# EAGLE design przetwornice5V,3V3,-5V (EAGLE 6.3)
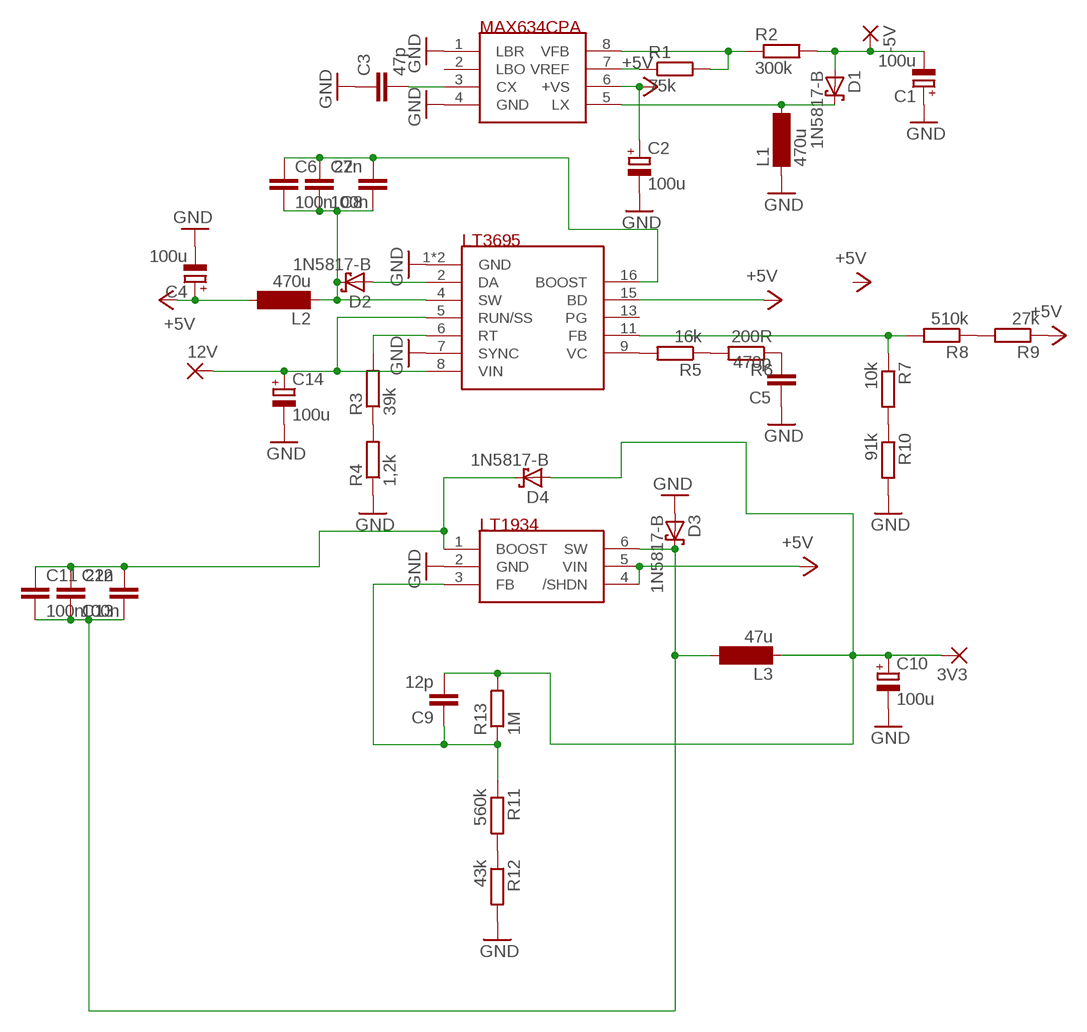
[diagram p0: schematic, sheet 1]

## Parts
3V3  WIREPAD2,54/0,8  [2,54/0,8]
12V  WIREPAD2,54/0,8  [2,54/0,8]
-5V  WIREPAD2,54/0,8  [2,54/0,8]
C1  100u  CPOL-EUE2.5-7  [E2,5-7]
C2  100u  CPOL-EUE2.5-7  [E2,5-7]
C3  47p  C2.5/2  [C2.5-2]
C4  100u  CPOL-EUE2.5-7  [E2,5-7]
C5  470p  C2.5/2  [C2.5-2]
C6  100n  C-EUC0805  [C0805]
C7  100n  C-EUC0805  [C0805]
C8  22n  C2.5/2  [C2.5-2]
C9  12p  C2.5/2  [C2.5-2]
C10  100u  CPOL-EUE2.5-7  [E2,5-7]
C11  100n  C-EUC0805  [C0805]
C12  100n  C-EUC0805  [C0805]
C13  22n  C2.5/2  [C2.5-2]
C14  100u  CPOL-EUE2.5-7  [E2,5-7]
D1  1N5817-B  [DO41-7.6]
D2  1N5817-B  [DO41-7.6]
D3  1N5817-B  [DO41-7.6]
D4  1N5817-B  [DO41-7.6]
L1  470u  MS50  [MS50]
L2  470u  MS50  [MS50]
L3  47u  MS50  [MS50]
R1  75k  R-EU_R0805  [R0805]
R2  300k  R-EU_R0805  [R0805]
R3  39k  R-EU_R0805  [R0805]
R4  1,2k  R-EU_R0805  [R0805]
R5  16k  R-EU_R0805  [R0805]
R6  200R  R-EU_R0805  [R0805]
R7  10k  R-EU_R0805  [R0805]
R8  510k  R-EU_R0805  [R0805]
R9  27k  R-EU_R0805  [R0805]
R10  91k  R-EU_R0805  [R0805]
R11  560k  R-EU_R0805  [R0805]
R12  43k  R-EU_R0805  [R0805]
R13  1M  R-EU_0207/10  [0207/10]
U$1  MAX634CPA  [DIL08]
U$2  LT3695  [MSOP16]
U$3  LT1934  [SOT23-6]

## Nets
+5V: C2.+ C4.+ L2.2 R9.1 U$1.6(+VS) U$2.15(BD) U$3.4(/SHDN) U$3.5(VIN)
GND: C1.+ C2.- C3.1 C4.- C5.1 C10.- C14.- D3.A L1.1 R4.1 R10.2 R12.2 U$1.1(LBR) U$1.4(GND) U$2.1(GND) U$2.7(SYNC) U$2.14(GND) U$3.2(GND)
N$1: R1.1 U$1.7(VREF)
N$2: R1.2 R2.1 U$1.8(VFB)
N$3: -5V.1(P) C1.- D1.A R2.2
N$4: D1.C L1.2 U$1.5(LX)
N$5: C3.2 U$1.3(CX)
N$6: 12V.1(P) C14.+ U$2.5(RUN/SS) U$2.8(VIN)
N$7: C11.2 C12.2 C13.1 D3.C L3.2 U$3.6(SW)
N$8: D2.A U$2.2(DA)
N$9: R3.1 R4.2
N$10: R3.2 U$2.6(RT)
N$11: R5.2 U$2.9(VC)
N$12: R5.1 R6.2
N$13: R7.1 R8.2 U$2.11(FB)
N$14: C5.2 R6.1
N$15: R8.1 R9.2
N$16: R7.2 R10.1
N$17: C6.1 C7.1 C8.2 U$2.16(BOOST)
N$18: C6.2 C7.2 C8.1 D2.C L2.1 U$2.4(SW)
N$20: R11.2 R12.1
N$21: C9.1 R11.1 R13.1 U$3.3(FB)
N$25: C11.1 C12.1 C13.2 D4.C U$3.1(BOOST)
N$26: 3V3.1(P) C9.2 C10.+ D4.A L3.1 R13.2
Unconnected: U$1.2(LBO) U$2.13(PG)

## Library data of the parts
3V3 12V -5V = wirepad:WIREPAD: Wire PAD connect wire on PCB
C1 C2 C4 C10 C14 = rcl:CPOL-EU: POLARIZED CAPACITOR, European symbol
C3 C5 C8 C9 C13 = capacitor-wima:C: CAPACITOR naming: grid - package width
C6 C7 C11 C12 = rcl:C-EU: CAPACITOR, European symbol
D1-D4 = diode:1N581*: 1.0A SCHOTTKY BARRIER RECTIFIER Source: http://www.diodes.com/datasheets/ds23001.pdf
L1-L3 = inductor-neosid:MS50: INDUCTOR SMD power inductor; OC_FARNELL: unknown; OC_NEWARK: unknown
R1-R13 = rcl:R-EU_: RESISTOR, European symbol
U$1 = ref-packages:MAX634CPA
U$2 = ref-packages:LT3695: 1A Fault Tolerant Micropower Step-Down Regulator
U$3 = ref-packages:LT1934: Micropower Step-Down Switching Regulators in ThinSOT and DFN

## Net classes
0 default: clearance 0.7 mm

## Board
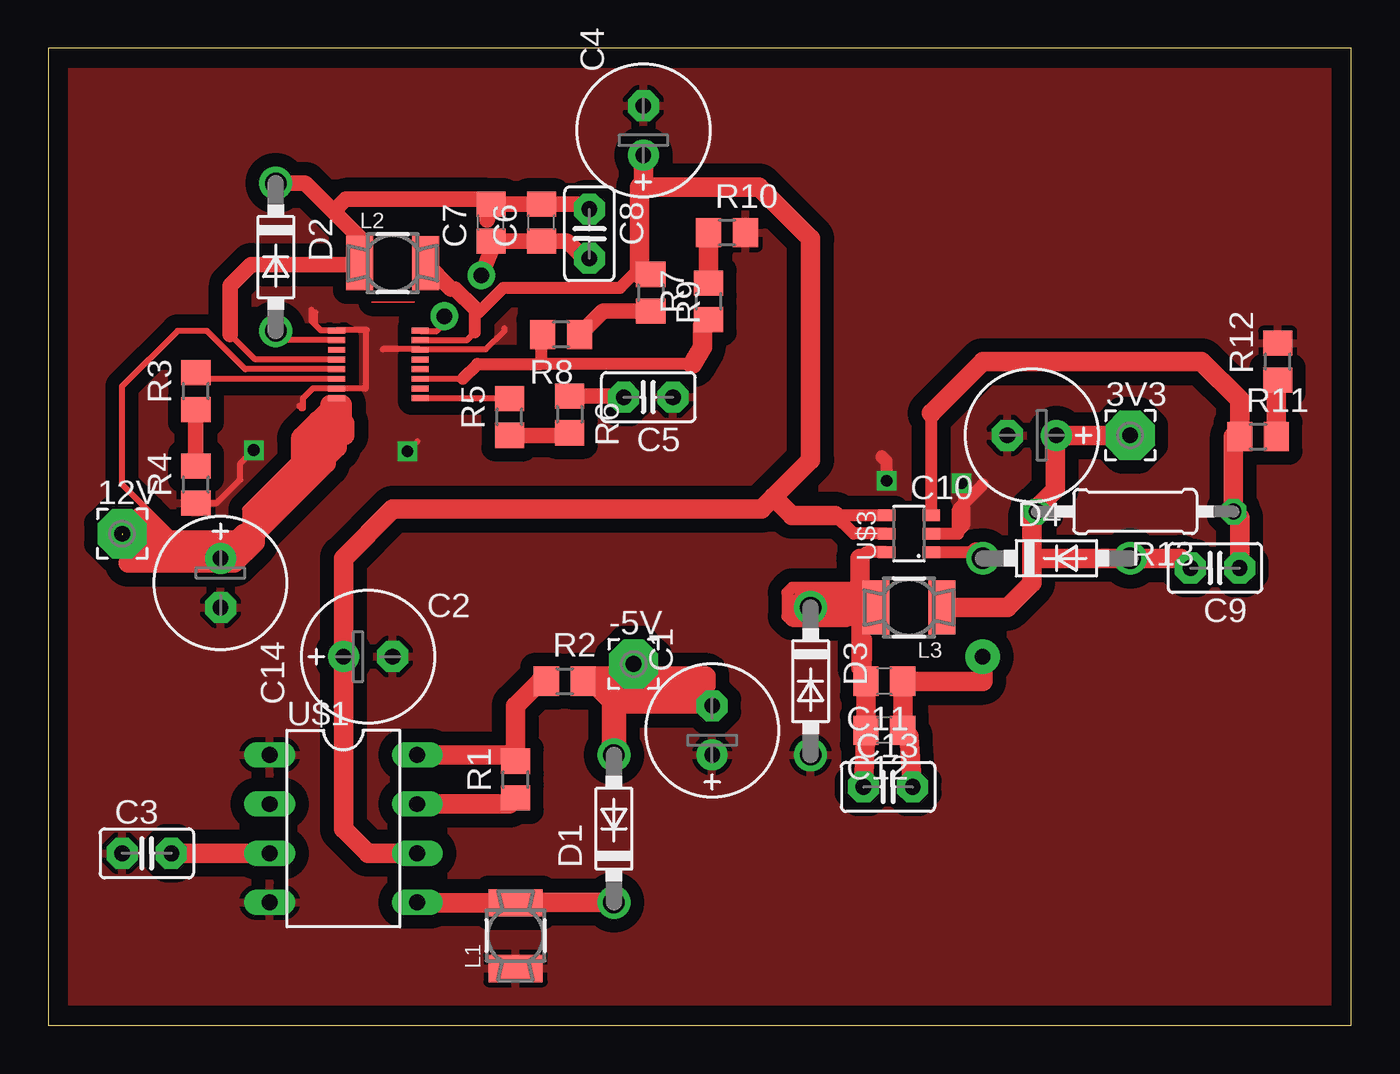
[diagram p1: board, top side]
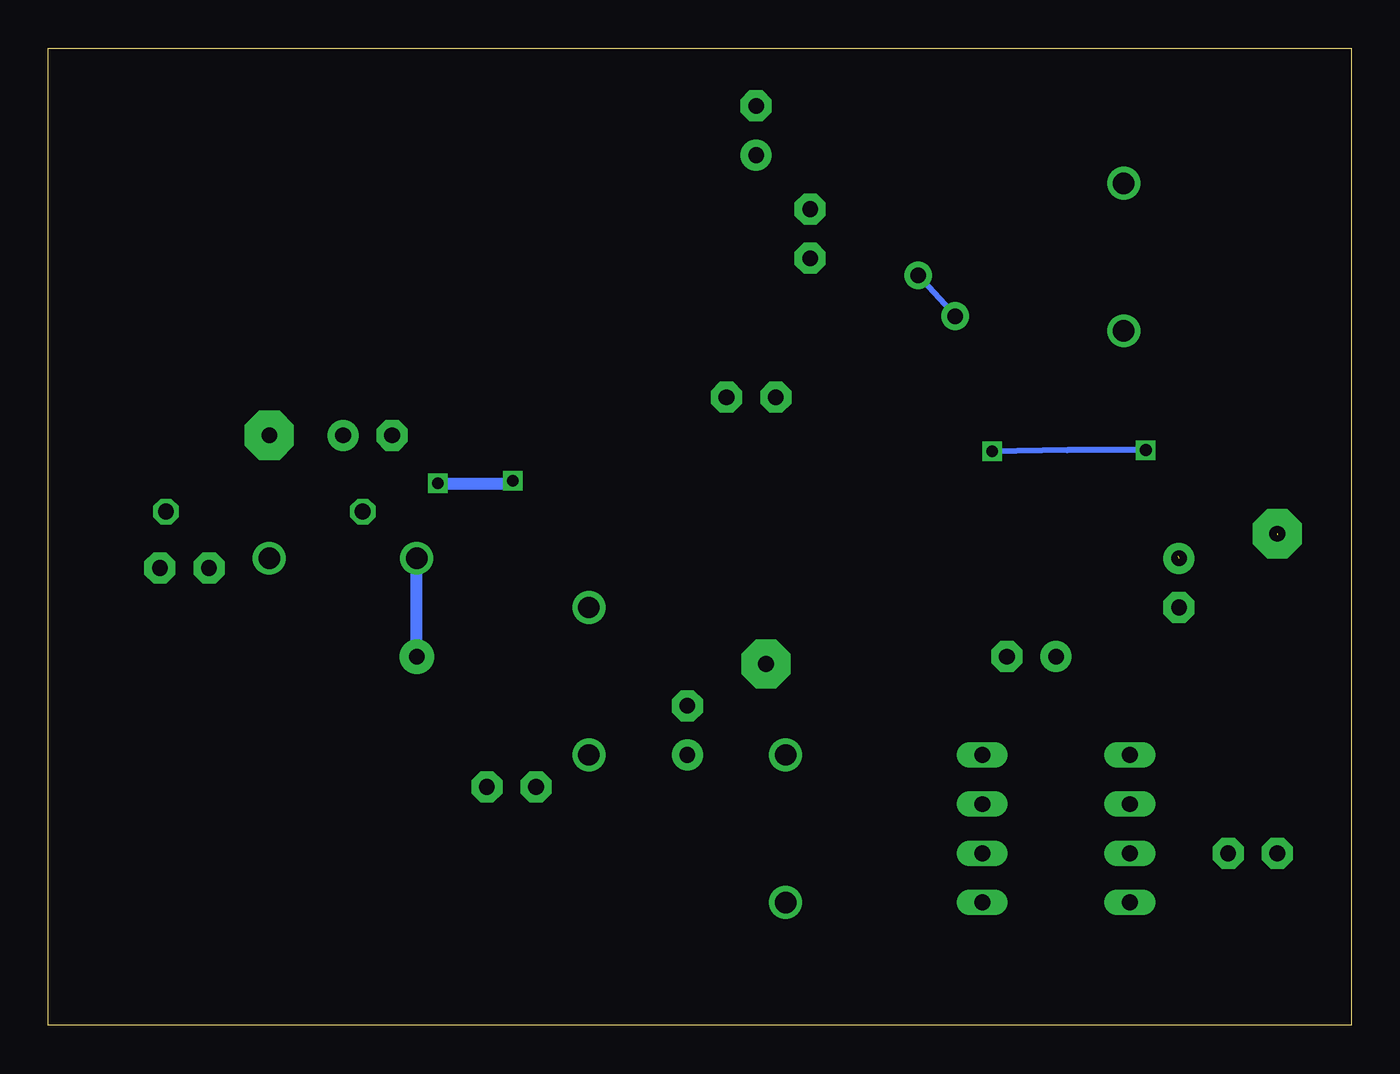
[diagram p2: board, bottom side, seen from below]

Size 67.29 x 50.47 mm. Coordinates in mm from the lower left corner, seen from the top.
Outline: 0,0 67.29,0 67.29,50.47 0,50.47 0,0
Copper layers (1*16): Top 0.035mm / dielectric 1.5mm / Bottom 0.035mm
Design rules "default": minimum track width 10mil, minimum drill 24mil, track to track 8mil, track to pad 8mil, pad to pad 8mil, via to via 8mil, smd to smd 8mil, copper to edge 40mil, drill to drill 8mil, minimum pad ring 10mil, minimum via ring 8mil, stop-mask expansion 4mil, vias tented up to drill 0mil, thermal gap 10mil

### Footprints (pad centres in the part's own frame; a part is rotated, then mirrored left to right if it is on the bottom)
2,54/0,8 = drill 0.813 pad 2.54 octagon: 1 0,0
E2,5-7 = drill 0.813 pad 1.6: + -1.27,0 | drill 0.813 pad 1.6 octagon: - 1.27,0
C2.5-2 = drill 0.813 pad 1.6 octagon: 1 -1.27,0; 2 1.27,0
C0805 = smd 1.3 x 1.5: 1 -0.95,0; 2 0.95,0
DO41-7.6 = drill 1.1 pad 1.7: A 3.81,0; C -3.81,0
MS50 = smd 2.8 x 1.4: 1 0,-1.7; 2 0,1.7
R0805 = smd 1.3 x 1.5: 1 -0.95,0; 2 0.95,0
0207/10 = drill 0.813 octagon: 1 -5.08,0; 2 5.08,0
DIL08 = drill 0.813 long: 1 -3.81,-3.81; 2 -1.27,-3.81; 3 1.27,-3.81; 4 3.81,-3.81; 5 3.81,3.81; 6 1.27,3.81; 7 -1.27,3.81; 8 -3.81,3.81
MSOP16 = smd 0.889 x 0.305: 1 -1.615,1.609; 2 -1.615,1.109; 3 -1.615,0.609; 4 -1.615,0.109; 5 -1.615,-0.391; 6 -1.615,-0.891; 7 -1.615,-1.391; 8 -1.615,-1.891; 9 2.695,-1.891; 10 2.695,-1.391; 11 2.695,-0.891; 12 2.695,-0.391; 13 2.695,0.109; 14 2.695,0.609; 15 2.695,1.109; 16 2.695,1.609
SOT23-6 = smd 0.6 x 0.9: 1 -0.95,-1.15; 2 0,-1.15; 3 0.95,-1.15; 4 0.95,1.15; 5 0,1.15; 6 -0.95,1.15

### Placement (x,y rotation side)
3V3  55.88,30.48 0 top
12V  3.81,25.4 0 top
-5V  30.23,18.67 0 top
C1  34.29,15.24 90 top
C2  16.51,19.05 0 top
C3  5.08,8.89 0 top
C4  30.73,46.23 90 top
C5  30.99,32.45 180 top
C6  25.46,41.47 90 top
C7  22.86,41.47 90 top
C8  27.94,40.89 270 top
C9  60.26,23.62 180 top
C10  50.8,30.48 180 top
C11  43.18,17.78 180 top
C12  43.18,15.24 180 top
C13  43.37,12.32 0 top
C14  8.89,22.86 270 top
D1  29.21,10.16 90 top
D2  11.75,39.69 270 top
D3  39.37,17.78 270 top
D4  52.07,24.13 0 top
L1  24.13,4.64 0 top
L2  17.78,39.37 270 top
L3  44.45,21.59 90 top
R1  24.13,12.7 90 top
R2  26.67,17.78 0 top
R3  7.62,32.77 90 top
R4  7.62,27.94 90 top
R5  23.81,31.43 90 top
R6  26.92,31.56 270 top
R7  34.1,37.4 90 top
R8  26.48,35.69 180 top
R9  31.12,37.85 270 top
R10  35.05,40.96 0 top
R11  62.48,30.42 0 top
R12  63.5,34.29 90 top
R13  56.13,26.54 180 top
U$1  15.24,10.16 270 top
U$2  16.51,34.29 0 top
U$3  44.45,25.4 90 top

### Tracks (layer width: path | path; a pad name or v marks a point on that pad's centre or on a via)
+5V
  Top 0.305: U$2.15 21.62,35.4 22.03,35.81 | 21.02,38.04 20.81,38.04 | 22.03,37.02 22.23,36.83
  Top 0.61: 22.03,35.81 22.03,37.02 | 22.23,36.83 23.5,38.1 29.53,38.1 30.22,38.8 30.54,38.8 R9.1 | U$3.4 40.64,26.35 41.59,25.4 U$3.5
  Top 0.813: 22.03,37.02 21.02,38.04 | 20.81,38.04 L2.2 | 30.54,43.31 30.73,43.5
  Top 1.016: U$1.6 16.51,8.89 15.24,10.16 C2.+ 15.24,24.13 17.78,26.67 36.83,26.67 37.47,27.3 | 37.47,27.3 39.37,29.21 39.37,40.64 36.7,43.31 30.54,43.31 30.54,38.8 | 30.73,43.5 C4.+ | 40.64,26.35 38.42,26.35 37.47,27.3
GND  (via drill 0.6)
  Top 0.305: 13.78,36.2 14.08,35.9 U$2.1 14.94,35.94 16.45,35.94 16.38,35.88 16.38,32.89 16.38,32.9 U$2.7 13.66,32.9 13.14,32.38 13.14,31.88 13.08,31.88 12.95,32 | 13.78,36.2 13.78,36.83 | 13.78,36.2 13.59,36.39 13.59,36.96 | R4.1 8.7,26.99 9.91,28.19 9.91,29.02 v10.6,29.72 | v18.54,29.66 19.05,30.16 | 23.56,36 23.56,35.88 22.61,34.92 19.23,34.92 U$2.14 19.18,34.92 17.27,34.92
  Top 0.61: 48.26,27.94 46.99,26.67 46.99,25.4 U$3.2 46.86,25.4 47.31,25.84 47.31,27.88 v47.18,28 | v43.31,28.13 43.31,29.15 43.05,29.4 43.05,29.34 43.18,29.21
  Bottom 0.305: v10.6,29.72 14.67,29.72 v18.54,29.66
  Bottom 0.61: v47.18,28 43.43,28 v43.31,28.13
  pour Top: -5.08,-5.08 72.39,-5.08 73.66,60.96 -3.81,60.96
N$1
  Top 0.813: 23.81,11.43 R1.1
  Top 1.016: U$1.7 23.81,11.43
N$2
  Top 0.813: 23.81,13.97 R1.2 | 25.4,17.78 R2.1
  Top 1.016: U$1.8 23.81,13.97 | R1.2 24.13,16.51 25.4,17.78
N$3
  Top 0.61: C1.- 34.29,16.83 33.91,17.21 29.84,17.21 | 29.84,17.21 29.53,16.89 29.53,17.65 29.59,17.72 33.97,17.72 34.16,17.53 34.16,18.1 34.04,18.23 28.19,18.23 29.08,17.34 29.08,17.91 | -5V.1 30.23,17.59 29.84,17.21
  Top 0.813: R2.2 27.94,17.78 29.21,16.51 C1.-
  Top 1.27: D1.A 29.21,16.51
N$4
  Top 0.813: 24.14,6.35 L1.2 | 19.06,6.34 U$1.5
  Top 1.016: D1.C 24.14,6.35 | L1.2 19.06,6.34
N$5
  Top 1.016: U$1.3 C3.2
N$6  (2 unrouted)
  Top 0.305: U$2.5 10.17,33.9 8.19,35.88 6.67,35.88 3.81,33.02 3.81,27.94 6.35,25.4 10.16,25.4 10.16,26.67 12.7,29.21 12.7,30.48 14.62,32.4 U$2.8
  Top 1.016: 14.29,31.37 14.54,31.37 14.54,32.07 15.18,32.07 15.18,31.24 | 15.18,31.24 13.91,31.24 13.08,30.42 13.14,30.42 | 13.14,30.42 14.48,31.75 | 13.14,30.42 13.02,30.29 13.02,29.02 12.89,28.89 12.89,28.83 10.54,26.48 10.54,25.46 10.48,25.4 | 10.48,25.4 10.16,25.4 10.1,25.4 8.95,24.26 8.76,24.26 8.06,24.96 9.33,24.96 9.4,25.02 6.22,25.02 5.97,25.27 | 5.91,25.34 4.95,26.29 4.76,26.29 3.81,25.34 5.91,25.34 | 5.91,25.34 5.97,25.27 | 5.97,25.27 4.76,25.27 4.19,24.7 8.57,24.7 8.83,24.45 4.7,24.45 4.13,23.88 9.59,23.88 10.67,24.96 10.67,25.4 13.65,28.38 13.65,29.72 13.59,29.78 | 10.48,25.4 10.73,25.4 14.35,29.02 14.35,29.27 14.92,29.85 14.54,29.85 14.16,30.23 14.41,30.23 14.73,30.54 15.24,30.54 15.3,30.48 15.3,31.11 15.18,31.24
N$7
  Top 0.61: U$3.6 42.23,24.45 41.91,24.13 | 41.91,22.43 42.11,22.23 | 42.11,22.23 L3.2 | C11.2 42.23,19.94 42.23,18.86 41.78,18.42 41.78,21.91 | 41.78,21.91 42.11,22.23 | 42.1,12.45 C13.1 | 41.78,21.91 41.78,22.23 41.4,22.61 38.42,22.61 38.16,22.35 38.16,21.15 38.42,20.89 41.27,20.89 41.47,21.08 41.47,21.72 41.15,22.04 38.73,22.04 38.67,21.97 38.67,21.34 41.02,21.34 41.08,21.4 41.08,21.59 41.02,21.65 39.43,21.65 D3.C
  Top 1.016: 41.91,24.13 41.91,22.43 | 42.1,12.45 C12.2 C11.2
N$8
  Top 0.305: U$2.2 12.23,35.4 D2.A
N$9
  Top 0.813: R3.1 R4.2
N$10
  Top 0.305: U$2.6 7.94,33.4 R3.2
N$11
  Top 0.305: U$2.9 23.8,32.4 R5.2
N$12
  Top 0.305: 26.8,30.48 R6.2
  Top 0.813: R5.1 26.8,30.48
N$13
  Top 0.305: U$2.11 21.4,33.4 | 25.47,35.18 R8.2 | R7.1 33.78,36.13
  Top 0.61: 21.4,33.4 22.16,34.16 25.46,34.16 | 25.46,34.16 25.47,35.18 | 33.27,34.16 25.46,34.16
  Top 1.016: 33.78,36.13 33.78,35.05 33.27,34.16
N$14
  Top 0.305: 29.72,32.51 C5.2
  Top 0.813: R6.1 29.72,32.51
N$15
  Top 0.813: R8.1 28.64,36.9 R9.2
N$16
  Top 0.305: R7.2
  Top 1.016: R7.2 R10.1
N$17  (via drill 0.8 pad 1.42)
  Top 0.305: U$2.16 19.23,35.88 20.07,35.88 20.45,36.2 v20.45,36.64 | 22.92,40.13 C7.1
  Top 0.813: C7.1 C6.1 26.8,40.51 27.62,39.69 C8.2 | v22.35,38.73 22.92,40.13
  Bottom 0.305: v20.45,36.64 v22.35,38.73
N$18
  Top 0.305: U$2.4 10.69,34.4 9.4,35.69 | 16.02,39.31 L2.1
  Top 0.61: 16.13,40.64 16.13,39.42 L2.1
  Top 0.813: 14.73,42.04 15.37,42.67 22.67,42.67 22.67,41.59 C7.2 C6.2 27.69,42.41 27.81,42.29 27.94,42.1 C8.1 | D2.C 13.27,43.5 14.73,42.04 | 14.73,42.04 16.13,40.64 | 9.4,35.69 9.4,38.23 10.48,39.31 16.02,39.31
N$20
  Top 0.61: 63.43,33.27 R12.1
  Top 1.016: R11.2 63.43,33.27
N$21
  Top 0.61: U$3.3 45.6,31.63 | 61.53,30.74 R11.1 | 61.53,26.23 R13.1
  Top 1.016: R13.1 61.21,30.42 R11.1 | 45.6,31.63 48.26,34.29 59.56,34.29 61.53,32.32 61.53,30.74 | C9.1 61.53,26.23
N$25  (via drill 0.8 pad 1.78)
  Top 0.61: U$3.1 47.94,24.45 | 44.45,14.92 C12.1
  Top 1.016: 47.94,24.45 D4.C | C13.2 44.45,14.92 | C12.1 C11.1 48.26,17.78 v48.26,19.05
  Bottom 0.61: v48.26,19.05 D4.C
N$26
  Top 0.61: 50.8,26.29 R13.2 | 52.01,30.42 C10.+
  Top 1.016: L3.1 49.53,21.59 50.8,22.86 50.8,24.13 | 50.8,24.13 50.8,26.29 | 50.8,24.13 D4.A 58.48,24.13 C9.2 | R13.2 51.05,26.73 52.01,27.69 52.01,30.42 | C10.+ 3V3.1
(copper drawn outside any net)
  shapes: Top area x1